# Altium schematic sheet Front Panel.schdoc
size 185 x 64 mm
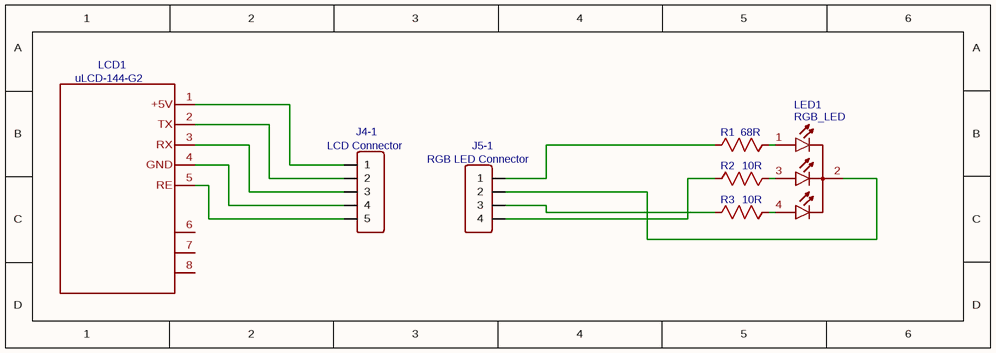
[diagram p0: Front Panel.schdoc]

## Parts
J4-1  LCD Connector  [HDR-M-2.54_1X5]
J5-1  RGB LED Connector  [HDR-M-2.54_1X4]
LCD1  uLCD-144-G2  [LCD9-1.5-30X19.5MM]
LED1  RGB_LED  [RGB-5MM]
R1  68R  [R0603]
R2  10R  [R0603]
R3  10R  [R0603]

## Nets
NetJ4-1_1: J4-1.1 LCD1.1(+5V)
NetJ4-1_2: J4-1.2 LCD1.2(TX)
NetJ4-1_3: J4-1.3 LCD1.3(RX)
NetJ4-1_4: J4-1.4 LCD1.4(GND)
NetJ4-1_5: J4-1.5 LCD1.5(RE)
NetJ5-1_1: J5-1.1(4) R2.1
NetJ5-1_2: J5-1.2(3) R3.1
NetJ5-1_3: J5-1.3(2) LED1.2
NetJ5-1_4: J5-1.4(1) R1.1
NetLED1_1: LED1.1 R1.2
NetLED1_3: LED1.3 R2.2
NetLED1_4: LED1.4 R3.2

Not connected (* = marked no-connect by the designer): LCD1 6(ARDUINO_RESET) 7(+5V) 8(GND)

## Library data of the parts
J4-1 = LCD Connector: Contributor: LCEDA_Lib; BOM_Supplier Part: C358687; BOM_Supplier: LCSC; spicePre: J; spiceSymbolName: HDR-M-2.54_1x5
J5-1 = RGB LED Connector: Contributor: LCEDA_Lib; BOM_Supplier Part: C124378; BOM_Supplier: LCSC; spicePre: J; spiceSymbolName: HDR-M-2.54_1x4
LCD1 = uLCD-144-G2: BOM_Manufacturer Part: 12 LCD Breadout; description: Tiny I2C Char LCD - 5V; Contributor: Thomas Cullen; spicePre: L; spiceSymbolName: uLCD_24DT
LED1 = RGB_LED: BOM_Manufacturer: KENTO; BOM_Manufacturer Part: φ5 RGB LED; Contributor: jousterde1; BOM_Supplier: LCSC; BOM_Supplier Part: C32985; spicePre: L; spiceSymbolName: RGB_LED_5-2
R1 = 68R: nameAlias: Value(Ω); Contributor: LCEDA_Lib; spicePre: R; spiceSymbolName: R_0603_US
R2 R3 = 10R: nameAlias: Value(Ω); Contributor: LCEDA_Lib; spicePre: R; spiceSymbolName: R_0603_US